# Altium project ElecStim.PrjPCB
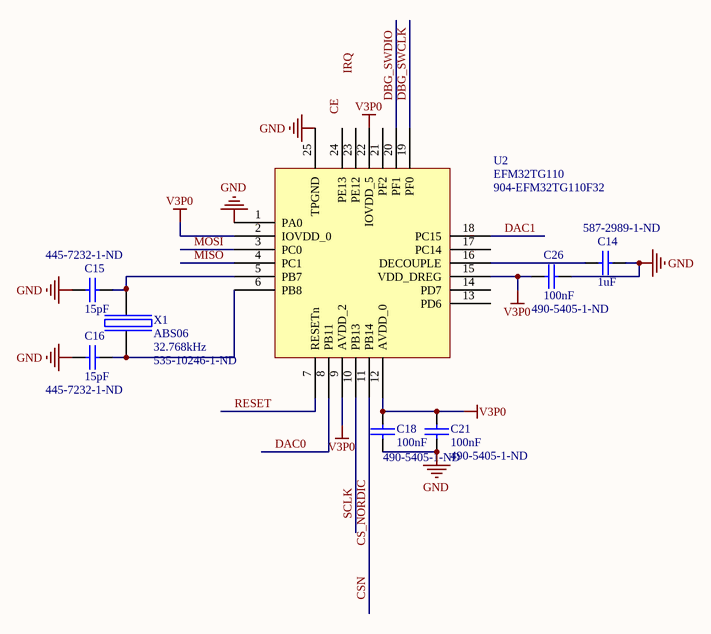
[diagram p0: MCU_EM.SchDoc]
4 sheets, 46 parts. Net scope: global (net labels, ports and power ports of the same name join across sheets).
Board file: PCB_Elec_stim.PcbDoc
Sheets:
  MCU_EM.SchDoc
  RF_Power_small_doubler.SchDoc
  Radio.SchDoc
  Bipolar_HCP.SchDoc

## Sheet MCU_EM.SchDoc
size A

### Parts
C14  value 1uF  Supplier Part Number 1: 587-2989-1-ND  [0402s]  (hidden comment: NP0 4V)
C15  value 15pF  Supplier Part Number 1: 445-7232-1-ND  [0201]  (hidden comment: NP0 50V)
C16  value 15pF  Supplier Part Number 1: 445-7232-1-ND  [0201]  (hidden comment: NP0 50V)
C18  value 100nF  Supplier Part Number 1: 490-5405-1-ND  [0201]  (hidden comment: NP0 10V)
C21  value 100nF  Supplier Part Number 1: 490-5405-1-ND  [0201]  (hidden comment: NP0 10V)
C26  value 100nF  Supplier Part Number 1: 490-5405-1-ND  [0402s]  (hidden comment: NP0 10V)
U2  EFM32TG110  Supplier Part Number 1: 904-EFM32TG110F32  [QFN24_EM]
X1  ABS06  Frequency: 32.768kHz  Supplier Part Number 1: 535-10246-1-ND  [ABS06]

### Nets
GND: C14.1 C15.1 C16.2 C18.2 C21.2 C26.2 U2.1(PA0) U2.25(TPGND)
V3P0: C18.1 C21.1 C26.1 U2.2(IOVDD_0) U2.9(AVDD_2) U2.12(AVDD_0) U2.15(VDD_DREG) U2.22(IOVDD_5)
CS_NORDIC: U2.11(PB14)  [also labelled CSN]
DAC0: U2.8(PB11)
DAC1: U2.18(PC15)
DBG_SWCLK: U2.19(PF0)
DBG_SWDIO: U2.20(PF1)
MISO: U2.4(PC1)
MOSI: U2.3(PC0)
RESET: U2.7(RESETn)
SCLK: U2.10(PB13)
NetC14_2: C14.2 U2.16(DECOUPLE)
NetC15_2: C15.2 U2.5(PB7) X1.1(inp)
NetC16_1: C16.1 U2.6(PB8) X1.2(out)

Not connected (* = marked no-connect by the designer): U2 13(PD6) 14(PD7) 17(PC14) 21(PF2) 23(PE12) 24(PE13)

### Notes on the sheet
- Labels drawn without touching a wire or pin: CE, IRQ

### Library data of the parts
C14 = Cap: Capacitor; Manufacturer: Taiyo Yuden; Manufacturer Part Number: AMK063ABJ105MP-F; Description: CAP CER 1UF 4V 20% X5R 0201; Capacitance: 1.0µF; Tolerance: ±20%; Temperature Coefficient: X5R; Supplier 1: Digi-Key; RoHS: RoHS Compliant; Category: Capacitors; Stock 1: 25231; Pricing 1: 1=0.56, 10=0.469, 50=0.336, 100=0.294, 250=0.231, 500=0.21, 1000=0.168, 5000=0.1295 (USD); Voltage - Rated: 4V; Mounting Type: Surface Mount, MLCC; Operating Temperature: -55°C ~ 85°C; Applications: General Purpose; Ratings: -; Package / Case: 0201 (0603 Metric); Size / Dimension: 0.024" L x 0.012" W (0.60mm x 0.30mm); Height - Seated (Max): -; Thickness (Max): 0.013" (0.33mm); Lead Spacing: -; Features: -; Packaging: Cut Tape (CT); Lead Style: -; ComponentLink1URL: http://www.yuden.co.jp/ut/product/pdf/mlcc01_e.pdf; ComponentLink1Description: http://www.yuden.co.jp/ut/product/pdf/mlcc01_e.pdf
C15 C16 = Cap: Capacitor; Part Field 1: 0402; Manufacturer: TDK Corporation; Manufacturer Part Number: C0603C0G1E150G; Description: CAP CER 15PF 25V 2% NP0 0201; Voltage - Rated: 25V; Tolerance: ±2%; Temperature Coefficient: C0G, NP0; Supplier 1: Digi-Key; RoHS: RoHS Compliant; Category: Capacitors; Stock 1: 29640; Pricing 1: 1=0.15, 10=0.093, 100=0.0333, 250=0.02404, 500=0.01776, 1000=0.01203 (USD); Capacitance: 15pF; Mounting Type: Surface Mount, MLCC; Operating Temperature: -55°C ~ 125°C; Applications: General Purpose; Ratings: -; Package / Case: 0201 (0603 Metric); Size / Dimension: 0.024" L x 0.012" W (0.60mm x 0.30mm); Height - Seated (Max): -; Thickness (Max): 0.013" (0.33mm); Lead Spacing: -; Features: -; Packaging: Cut Tape (CT); Lead Style: -; ComponentLink1URL: http://www.tdk.com/pdf/general_B11.pdf; ComponentLink1Description: http://www.tdk.com/pdf/general_B11.pdf
C18 C21 C26 = Cap: Capacitor; Part Field 1: 0402; Manufacturer: Murata Electronics North America; Manufacturer Part Number: GRM033R61A104ME15D; Description: CAP CER 0.1UF 10V 20% X5R 0201; Capacitance: 0.1µF; Tolerance: ±20%; Temperature Coefficient: X5R; Supplier 1: Digi-Key; RoHS: RoHS Compliant; Category: Capacitors; Stock 1: 1087710; Pricing 1: 10=0.05, 50=0.0396, 100=0.0297, 250=0.02144, 500=0.01584, 1000=0.01073, 5000=0.00825 (USD); Voltage - Rated: 10V; Mounting Type: Surface Mount, MLCC; Operating Temperature: -55°C ~ 85°C; Applications: General Purpose; Ratings: -; Package / Case: 0201 (0603 Metric); Size / Dimension: 0.024" L x 0.012" W (0.60mm x 0.30mm); Height - Seated (Max): -; Thickness (Max): 0.013" (0.33mm); Lead Spacing: -; Features: -; Packaging: Cut Tape (CT); Lead Style: -; ComponentLink1URL: http://www.murata.com/products/catalog/pdf/c02e.pdf; ComponentLink1Description: http://www.murata.com/products/catalog/pdf/c02e.pdf
U2 = EFM32TG110: EFM32TG110F32; Manufacturer: Energy Micro; Description: Microcontrollers (MCU) 32KB Flash 4KB RAM; Program Memory Type: Flash; Data RAM Size: 32 KB; Interface Type: UART, I2C, SPI; Core: ARM Cortex M3; Data Bus Width: 32 bit; Maximum Clock Frequency: 32 MHz; Number of Programmable I/Os: 17; Number of Timers: 1; Operating Supply Voltage: 1.8 V to 3.8 V; Processor Series: EFM32; Product Status: New Technology; Supplier 1: Mouser; Manufacturer Part Number: EFM32TG110F32; RoHS: RoHS Compliant; Category: Microcontrollers (MCU); Stock 1: 0; Pricing 1: 1=5.13, 10=4.66, 25=4.27, 100=3.87, 250=3.48, 500=3.20, 1000=2.61 (AUD); Package / Case: QFN-24; Mounting Style: SMD/SMT; Program Memory Size: 32 KB; Maximum Operating Temperature: + 85 C; RoHS - Mouser: Y; Minimum Order Quantity: 1; Reeling: False; ComponentLink1URL: http://cdn.energymicro.com/dl/devices/pdf/d0013_efm32tg110_datasheet.pdf; ComponentLink1Description: http://cdn.energymicro.com/dl/devices/pdf/d0013_efm32tg110_datasheet.pdf
X1 = ABS06: Manufacturer: Abracon Corporation; Manufacturer Part Number: ABS06-32.768KHZ-9-T; Description: CRYSTAL 32.768 KHZ 9.0 PF SMD; Frequency Tolerance: ±20ppm; Load Capacitance: 9pF; Operating Mode: Fundamental; Supplier 1: Digi-Key; RoHS: RoHS Compliant; Category: Crystals and Oscillators; Stock 1: 7776; Pricing 1: 1=2.55, 10=2.21, 50=1.938, 100=1.53, 500=1.292 (USD); Type: kHz Crystal (Tuning Fork); Frequency Stability: -; Operating Temperature: -40°C ~ 85°C; Mounting Type: Surface Mount; Package / Case: 2-SMD; Size / Dimension: 0.079" L x 0.047" W (2.00mm x 1.20mm); Height: 0.024" (0.60mm); Packaging: Cut Tape (CT); ComponentLink1URL: http://www.abracon.com/Resonators/ABS06.pdf; ComponentLink1Description: http://www.abracon.com/Resonators/ABS06.pdf

## Sheet RF_Power_small_doubler.SchDoc
size A
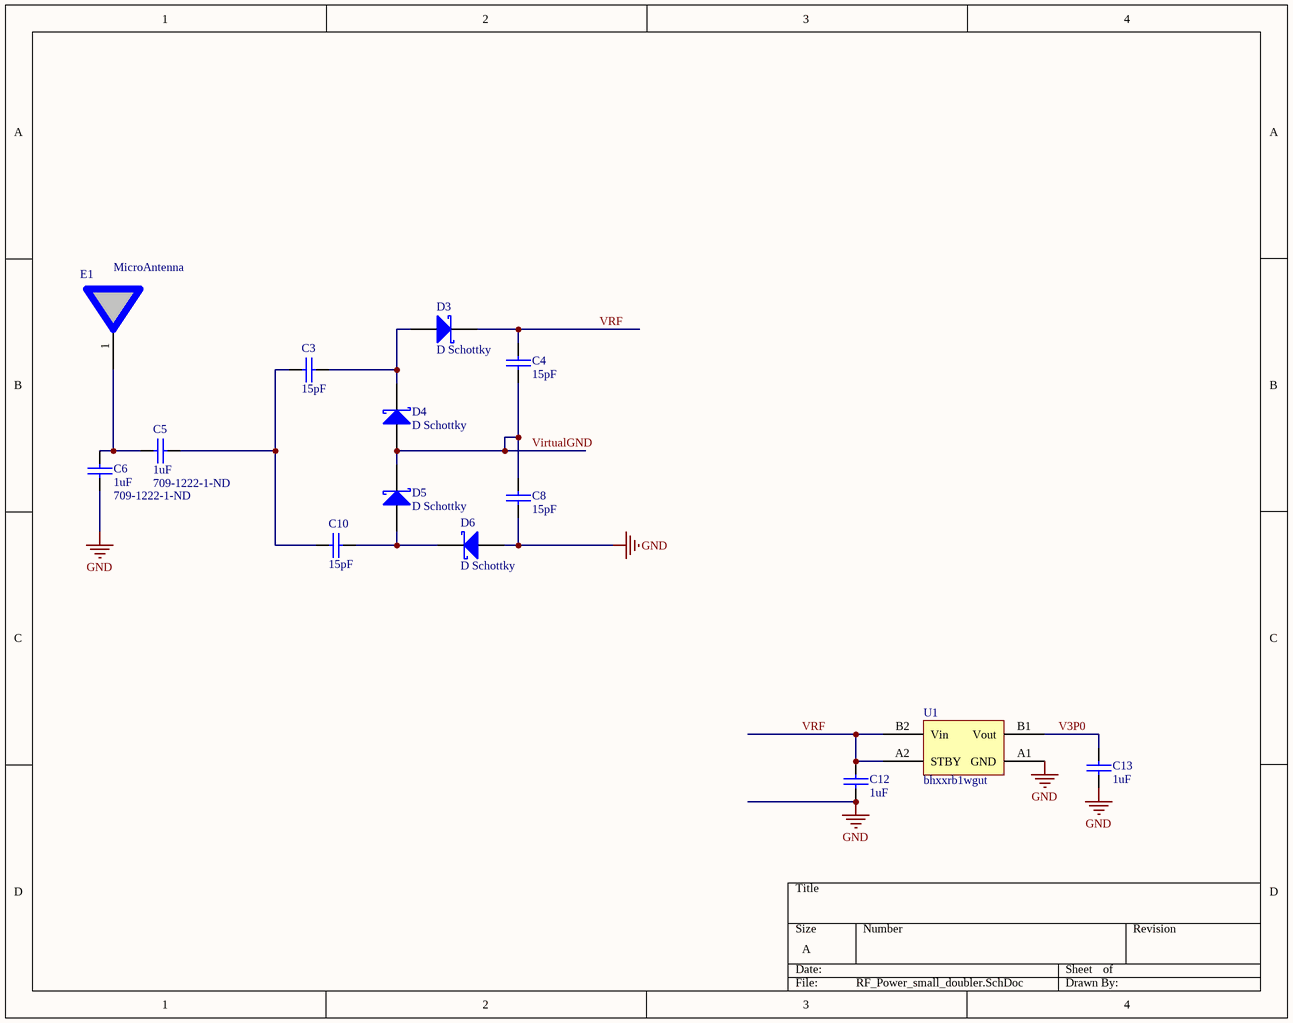
[diagram p1: RF_Power_small_doubler.SchDoc]

### Parts
C3  value 15pF  [0201]  (hidden comment: NP0 50V)
C4  value 15pF  [0201]  (hidden comment: NP0 50V)
C5  value 1uF  Supplier Part Number 1: 709-1222-1-ND  [0402]  (hidden comment: NP0 50V)
C6  value 1uF  Supplier Part Number 1: 709-1222-1-ND  [0402]  (hidden comment: NP0 50V)
C8  value 15pF  [0201]  (hidden comment: NP0 50V)
C10  value 15pF  [0201]  (hidden comment: NP0 50V)
C12  value 1uF  [CAPC1005L]  (hidden comment: NP0 50V)
C13  value 1uF  [CAPC1005L]  (hidden comment: NP0 50V)
D3  D Schottky  [Diode0201]
D4  D Schottky  [Diode0201]
D5  D Schottky  [Diode0201]
D6  D Schottky  [Diode0201]
E1  MicroAntenna  [2450AT18B100]
U1  bhxxrb1wgut  [BGA2x2_p5]

### Nets
GND: C6.2 C8.2 C12.2 C13.1 D6.1(A) U1.A1(GND)
V3P0: C13.2 U1.B1(Vout)
VirtualGND: C4.2 C8.1 D4.1(A) D5.2(K)
VRF: C4.1 C12.1 D3.2(K) U1.A2(STBY) U1.B2(Vin)
NetC3_1: C3.1 D3.1(A) D4.2(K)
NetC3_2: C3.2 C5.1 C10.2
NetC5_2: C5.2 C6.1 E1.1
NetC10_1: C10.1 D5.1(A) D6.2(K)

Not connected (* = marked no-connect by the designer): E1 2

### Library data of the parts
C3 C4 C8 C10 = Cap: Capacitor; Part Field 1: 0201
C5 C6 = Cap: Capacitor; Manufacturer: Johanson Dielectrics Inc; Manufacturer Part Number: 100R07X105KV4T; Description: CAP CER 1UF 10V X5R 0402; Capacitance: 1.0µF; Voltage - Rated: 10V; Tolerance: ±10%; Temperature Coefficient: X5R; Part Field 1: 0402; Supplier 1: Digi-Key; RoHS: RoHS Compliant; Category: Capacitors; Stock 1: 22620; Pricing 1: 10=0.146, 100=0.0861, 500=0.04968, 1000=0.03445 (USD); Mounting Type: Surface Mount, MLCC; Operating Temperature: -55°C ~ 85°C; Applications: SMPS Filtering; Ratings: -; Package / Case: 0402 (1005 Metric); Size / Dimension: 0.040" L x 0.020" W (1.02mm x 0.51mm); Height: -; Thickness: 0.025" (0.64mm); Lead Spacing: -; Features: -; Packaging: Cut Tape (CT); Lead Style: -; ComponentLink1URL: http://www.johansondielectrics.com/images/stories/surface-mount/tanceram/JDI_Tanceram_2010-03.pdf; ComponentLink1Description: http://www.johansondielectrics.com/images/stories/surface-mount/tanceram/JDI_Tanceram_2010-03.pdf
C12 C13 = Cap: Capacitor; Part Field 1: 0201
D3-D6 = D Schottky: Schottky Diode; Published: 8-Jun-2000; LatestRevisionDate: 17-Jul-2002; LatestRevisionNote: Re-released for DXP Platform.; PackageReference: SMB; Publisher: Altium Limited; PackageDescription: DO-214-AA/SMB; 2 C-Bend Leads; Body 5.3 x 3.6 mm, inc. leads (LxW); Code_JEDEC: DO-214-AA

## Sheet Radio.SchDoc
size A
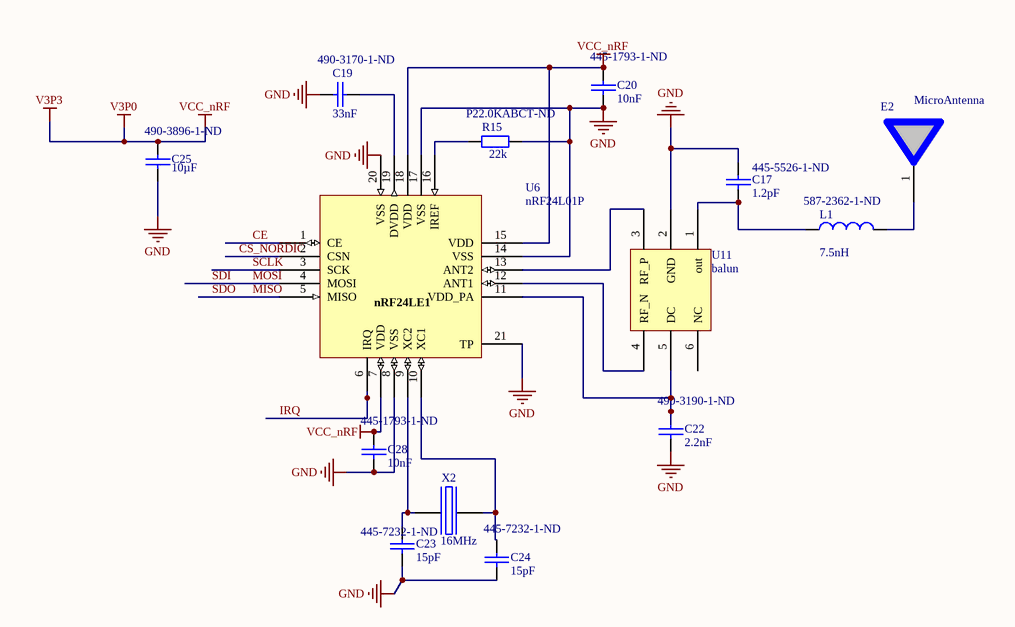
[diagram p2: Radio.SchDoc]

### Parts
C17  value 1.2pF  Supplier Part Number 1: 445-5526-1-ND  [0201]  (hidden comment: NP0 50V)
C19  value 33nF  Supplier Part Number 1: 490-3170-1-ND  [0201]  (hidden comment: NP0 50V)
C20  value 10nF  Supplier Part Number 1: 445-1793-1-ND  [0201]  (hidden comment: NP0 50V)
C22  value 2.2nF  Supplier Part Number 1: 490-3190-1-ND  [0201]  (hidden comment: NP0 50V)
C23  value 15pF  Supplier Part Number 1: 445-7232-1-ND  [0603]  (hidden comment: NP0 50V)
C24  value 15pF  Supplier Part Number 1: 445-7232-1-ND  [0603]  (hidden comment: NP0 50V)
C25  Supplier Part Number 1: 490-3896-1-ND  Capacitance: 10µF  [1608[0603]]  (hidden comment: NP0 50V)
C28  value 10nF  Supplier Part Number 1: 445-1793-1-ND  [0201]  (hidden comment: NP0 50V)
E2  MicroAntenna  [microantenna]
L1  value 7.5nH  Supplier Part Number 1: 587-2362-1-ND  [0201]  (hidden comment: Inductor)
R15  value 22k  Supplier Part Number 1: P22.0KABCT-ND  [0201]  (hidden comment: Res2)
U6  value nRF24L01P  [NORDIC_QFN20P400X400X90-25N]  (hidden comment: QFN24 4x4 package)
U11  balun  [balun]
X2  value 16MHz  [bt-xtal 2.5 x 2 mm]  (hidden comment: TSX-3225, 16MHz, Cl=9pF, +/-10ppm)

### Nets
GND: C17.1 C19.1 C20.2 C22.2 C23.2 C24.1 C25.2 C28.2 R15.2 U6.8(VSS) U6.14(VSS) U6.17(VSS) U6.20(VSS) U6.21(TP) U11.2(GND) X2.2(GND) X2.4(GND)
V3P0: C20.1 C25.1 C28.1 U6.7(VDD) U6.15(VDD) U6.18(VDD)  [also labelled V3P3, VCC_nRF]
CE: U6.1(CE)
CS_NORDIC: U6.2(CSN)
IRQ: U6.6(IRQ)
MISO: U6.5(MISO)  [also labelled SDO]
MOSI: U6.4(MOSI)  [also labelled SDI]
SCLK: U6.3(SCK)
NetC17_2: C17.2 L1.1 U11.1(out)
NetC19_2: C19.2 U6.19(DVDD)
NetC22_1: C22.1 U6.11(VDD_PA) U11.5(DC)
NetC23_1: C23.1 U6.9(XC2) X2.1(inp)
NetC24_2: C24.2 U6.10(XC1) X2.3(out)
NetE2_1: E2.1 L1.2
NetR15_1: R15.1 U6.16(IREF)
NetU6_12: U6.12(ANT1) U11.4(RF_N)
NetU6_13: U6.13(ANT2) U11.3(RF_P)

Not connected (* = marked no-connect by the designer): E2 2; U11 6(NC)

### Notes on the sheet
- (in symbol nRF24L01P - 4x4) nRF24LE1

### Library data of the parts
C17 = Cap: Capacitor; Part Field 1: 0402; Manufacturer: TDK Corporation; Manufacturer Part Number: C0603C0G1E1R2BTQ; Description: CAP CER 1.2PF 25V NP0 0201; Voltage - Rated: 25V; Tolerance: ±0.1pF; Temperature Coefficient: C0G, NP0; Supplier 1: Digi-Key; RoHS: RoHS Compliant; Category: Capacitors; Stock 1: 22019; Pricing 1: 1=0.33, 10=0.22, 100=0.088, 250=0.06324, 500=0.0451, 1000=0.033 (USD); Capacitance: 1.2pF; Mounting Type: Surface Mount, MLCC; Operating Temperature: -55°C ~ 125°C; Applications: RF, Microwave, High Frequency; Ratings: -; Package / Case: 0201 (0603 Metric); Size / Dimension: 0.024" L x 0.012" W (0.60mm x 0.30mm); Height - Seated (Max): -; Thickness (Max): 0.013" (0.33mm); Lead Spacing: -; Features: High Q, Low Loss; Packaging: Cut Tape (CT); Lead Style: -; ComponentLink1URL: http://www.tdk.com/pdf/high_q_B11.pdf; ComponentLink1Description: http://www.tdk.com/pdf/high_q_B11.pdf
C19 = Cap: Capacitor; Part Field 1: 0402; Manufacturer: Murata Electronics North America; Manufacturer Part Number: GRM033R60J333KE01D; Description: CAP CER 0.033UF 6.3V X5R 0201; Capacitance: 0.033µF; Voltage - Rated: 6.3V; Tolerance: ±10%; Temperature Coefficient: X5R; Supplier 1: Digi-Key; RoHS: RoHS Compliant; Category: Capacitors; Stock 1: 79017; Pricing 1: 10=0.05, 50=0.0396, 100=0.0297, 250=0.02144, 500=0.01584, 1000=0.01073 (USD); Mounting Type: Surface Mount, MLCC; Operating Temperature: -55°C ~ 85°C; Applications: General Purpose; Ratings: -; Package / Case: 0201 (0603 Metric); Size / Dimension: 0.024" L x 0.012" W (0.60mm x 0.30mm); Height - Seated (Max): -; Thickness (Max): 0.013" (0.33mm); Lead Spacing: -; Features: -; Packaging: Cut Tape (CT); Lead Style: -; ComponentLink1URL: http://search.murata.co.jp/Ceramy/image/img/PDF/ENG/GRM033R60J333KE01.pdf; ComponentLink1Description: http://search.murata.co.jp/Ceramy/image/img/PDF/ENG/GRM033R60J333KE01.pdf
C20 C28 = Cap: Capacitor; Part Field 1: 0402; Manufacturer: TDK Corporation; Manufacturer Part Number: C0603X5R1A103K; Description: CAP CER 10000PF 10V 10% X5R 0201; Capacitance: 10000pF; Voltage - Rated: 10V; Tolerance: ±10%; Temperature Coefficient: X5R; Supplier 1: Digi-Key; RoHS: RoHS Compliant; Category: Capacitors; Stock 1: 651645; Pricing 1: 1=0.08, 10=0.05, 100=0.018, 250=0.013, 500=0.0096, 1000=0.0065 (USD); Mounting Type: Surface Mount, MLCC; Operating Temperature: -55°C ~ 85°C; Applications: General Purpose; Ratings: -; Package / Case: 0201 (0603 Metric); Size / Dimension: 0.024" L x 0.012" W (0.60mm x 0.30mm); Height - Seated (Max): -; Thickness (Max): 0.013" (0.33mm); Lead Spacing: -; Features: -; Packaging: Cut Tape (CT); Lead Style: -; ComponentLink1URL: http://www.tdk.com/pdf/general_B11.pdf; ComponentLink1Description: http://www.tdk.com/pdf/general_B11.pdf
C22 = Cap: Capacitor; Manufacturer: Murata Electronics North America; Manufacturer Part Number: GRM033R71C222KA88D; Description: CAP CER 2200PF 16V 10% X7R 0201; Capacitance: 2200pF; Voltage - Rated: 16V; Tolerance: ±10%; Temperature Coefficient: X7R; Supplier 1: Digi-Key; RoHS: RoHS Compliant; Category: Capacitors; Stock 1: 60723; Pricing 1: 10=0.032, 50=0.0252, 100=0.0189, 250=0.01364, 500=0.01008, 1000=0.00683, 5000=0.00525 (USD); Mounting Type: Surface Mount, MLCC; Operating Temperature: -55°C ~ 125°C; Applications: General Purpose; Ratings: -; Package / Case: 0201 (0603 Metric); Size / Dimension: 0.024" L x 0.012" W (0.60mm x 0.30mm); Height - Seated (Max): -; Thickness (Max): 0.013" (0.33mm); Lead Spacing: -; Features: -; Packaging: Cut Tape (CT); Lead Style: -; ComponentLink1URL: http://search.murata.co.jp/Ceramy/image/img/PDF/ENG/GRM033R71C222KA88.pdf; ComponentLink1Description: http://search.murata.co.jp/Ceramy/image/img/PDF/ENG/GRM033R71C222KA88.pdf
C23 C24 = Cap: as C15 on sheet MCU_EM; Supplier 1: Digi-Key; RoHS: RoHS Compliant; Category: Capacitors; Stock 1: 29640; Pricing 1: 1=0.15, 10=0.093, 100=0.0333, 250=0.02404, 500=0.01776, 1000=0.01203 (USD); Capacitance: 15pF; Mounting Type: Surface Mount, MLCC; Operating Temperature: -55°C ~ 125°C; Applications: General Purpose; Ratings: -; Package / Case: 0201 (0603 Metric); Size / Dimension: 0.024" L x 0.012" W (0.60mm x 0.30mm); Height - Seated (Max): -; Thickness (Max): 0.013" (0.33mm); Lead Spacing: -; Features: -; Packaging: Cut Tape (CT); Lead Style: -; ComponentLink1URL: http://www.tdk.com/pdf/general_B11.pdf; ComponentLink1Description: http://www.tdk.com/pdf/general_B11.pdf
C25 = Cap: Capacitor; Part Field 1: 0402; Manufacturer: Murata Electronics North America; Manufacturer Part Number: GRM188R60J106ME47D; Value: 10uF; Description: CAP CER 10UF 6.3V X5R 0603; Voltage - Rated: 6.3V; Tolerance: ±20%; Temperature Coefficient: X5R; Supplier 1: Digi-Key; RoHS: RoHS Compliant; Category: Capacitors; Stock 1: 1364710; Pricing 1: 1=0.51, 10=0.398, 50=0.2624, 100=0.208, 250=0.15376, 500=0.1194, 1000=0.09407 (USD); Mounting Type: Surface Mount, MLCC; Operating Temperature: -55°C ~ 85°C; Applications: General Purpose; Ratings: -; Package / Case: 0603 (1608 Metric); Size / Dimension: 0.063" L x 0.031" W (1.60mm x 0.80mm); Height: -; Thickness: 0.035" (0.90mm); Lead Spacing: -; Features: -; Packaging: Cut Tape (CT); Lead Style: -; ComponentLink1URL: http://search.murata.co.jp/Ceramy/image/img/PDF/ENG/GRM188R60J106ME47.pdf; ComponentLink1Description: http://search.murata.co.jp/Ceramy/image/img/PDF/ENG/GRM188R60J106ME47.pdf
L1 = Inductor: Manufacturer: Taiyo Yuden; Manufacturer Part Number: HKQ0603S7N5H-T; Code_IEC: 1005; Description: INDUCTOR HI FREQ 7.5NH 0201; Current: 200mA; Tolerance: ±3%; DC Resistance (DCR): 510 mOhm Max; Q @ Freq: 13 @ 500MHz; Frequency - Self Resonant: 4.6GHz; Frequency - Test: 500MHz; Published: 8-Jun-2000; LatestRevisionDate: 29-May-2009; LatestRevisionNote: IPC-7351 Footprint Added.; PackageReference: 0402-A; Publisher: Altium Limited; PackageDescription: Chip Inductor; Code_JEITA: 0402; Supplier 1: Digi-Key; RoHS: RoHS Compliant; Category: Inductors, Coils, Chokes; Stock 1: 99075; Pricing 1: 1=0.06, 10=0.052, 50=0.0488, 100=0.0455, 500=0.03576, 1000=0.02925, 5000=0.0234 (USD); Inductance: 7.5nH; Current - Saturation: -; Current - Temperature Rise: -; Type: -; Shielding: -; Package / Case: 0201 (0603 Metric); Mounting Type: Surface Mount; Packaging: Cut Tape (CT); Operating Temperature: -55°C ~ 125°C; Material - Core: -; Applications: High Frequency; ComponentLink1URL: http://www.yuden.co.jp/productdata/catalog/en/mlci05_e.pdf; ComponentLink1Description: http://www.yuden.co.jp/productdata/catalog/en/mlci05_e.pdf
R15 = Res2: Resistor; Manufacturer: Panasonic - ECG; Manufacturer Part Number: ERJ-1GEF2202C; Description: RES 22.0K OHM 1/20W 1% 0201 SMD; Power (Watts): 0.05W, 1/20W; Temperature Coefficient: ±200ppm/°C; Tolerance: ±1%; Category: Resistors; Supplier 1: Digi-Key; RoHS: RoHS Compliant; Stock 1: 526882; Pricing 1: 1=0.11, 50=0.0414, 100=0.0315, 250=0.0234, 500=0.01728, 1000=0.01152, 5000=0.0081 (USD); Resistance (Ohms): 22K; Composition: Thick Film; Features: -; Size / Dimension: 0.024" L x 0.012" W (0.60mm x 0.30mm); Height: 0.010" (0.26mm); Number of Terminations: 2; Packaging: Cut Tape (CT); Package / Case: 0201 (0603 Metric); ComponentLink1URL: http://industrial.panasonic.com/www-data/pdf/AOA0000/AOA0000CE2.pdf; ComponentLink1Description: http://industrial.panasonic.com/www-data/pdf/AOA0000/AOA0000CE2.pdf
U6 = nRF24L01P - 4x4: 2.4GHz Tranceiver with embedded MCU and 10 bit ADC
X2 = BT-XTAL: Crystal; Manufacturer: NDK; Manufacturer Part Number: NX2520SA-16.000000MHZ; Description: CRYSTAL 16.000000 MHZ 10PF SMD; Frequency Stability: ±10ppm; Load Capacitance: 10pF; Operating Mode: Fundamental; Supplier 1: Digi-Key; Supplier Part Number 1: 644-1059-1-ND; RoHS: RoHS Compliant; Category: Crystals and Oscillators; Stock 1: 12667; Pricing 1: 1=2.12, 10=1.839, 50=1.6128, 100=1.2733, 500=1.07524, 750=0.93943, 1000=0.84888 (USD); Type: MHz Crystal; Frequency: 16MHz; Frequency Tolerance: ±10ppm; Operating Temperature: -10°C ~ 60°C; Mounting Type: Surface Mount; Package / Case: 4-SMD, No Lead (DFN, LCC); Size / Dimension: 0.098" L x 0.079" W (2.50mm x 2.00mm); Height: 0.026" (0.65mm); Packaging: Cut Tape (CT); ComponentLink1URL: http://media.digikey.com/pdf/Data%20Sheets/NDK%20PDFs/NX2520SA.pdf; ComponentLink1Description: http://media.digikey.com/pdf/Data%20Sheets/NDK%20PDFs/NX2520SA.pdf

## Sheet Bipolar_HCP.SchDoc
size A
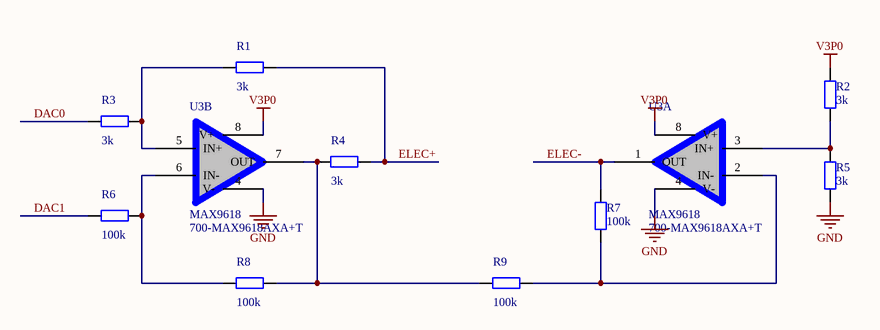
[diagram p3: Bipolar_HCP.SchDoc]

### Parts
R1  value 3k  [0402]  (hidden comment: Res2)
R2  value 3k  [0201]  (hidden comment: Res2)
R3  value 3k  [0402]  (hidden comment: Res2)
R4  value 3k  [0201]  (hidden comment: Res2)
R5  value 3k  [0201]  (hidden comment: Res2)
R6  value 100k  [0201]  (hidden comment: Res2)
R7  value 100k  [0201]  (hidden comment: Res2)
R8  value 100k  [0201]  (hidden comment: Res2)
R9  value 100k  [0201]  (hidden comment: Res2)
U3  MAX9618  Supplier Part Number 1: 700-MAX9618AXA+T  [MAX_X8CN_SC70_8]  (parts A,B of 2)

### Nets
GND: R5.2 U3.4(V-)
V3P0: R2.1 U3.8(V+)
DAC0: R3.2
DAC1: R6.2
ELEC+: R1.1 R4.1
ELEC-: R7.1 U3.1(OUT)
NetR1_2: R1.2 R3.1 U3.5(IN+)
NetR2_2: R2.2 R5.1 U3.3(IN+)
NetR4_2: R4.2 R8.1 R9.2 U3.7(OUT)
NetR6_1: R6.1 R8.2 U3.6(IN-)
NetR7_2: R7.2 R9.1 U3.2(IN-)

### Library data of the parts
R1-R9 = Res2: Resistor; Category: Resistors
U3 = MAX9618: Manufacturer: Maxim Integrated Products; Manufacturer Part Number: MAX9618AXA+T; Description: Op Amps Dual Auto-Zero Op Amp; Input Bias Current (Max): 3.5 nA; Supply Current: 59 uA; Common Mode Rejection Ratio (Min): 116 dB; Slew Rate: 0.7 V/us; Input Offset Voltage: 0.8 uV; Product Status: New at Mouser; Supplier 1: Mouser; RoHS: RoHS Compliant; Category: Op Amps; Stock 1: 1997; Pricing 1: 1=3.95, 25=2.92, 100=2.12, 500=1.84 (USD); Package / Case: SC70-8; Packaging: Reel; Mounting Style: SMD/SMT; Maximum Operating Temperature: + 125 C; Minimum Operating Temperature: - 40 C; Standard Pack Qty: 2500; RoHS - Mouser: Y; Minimum Order Quantity: 1; Reeling: True; ComponentLink1URL: http://datasheets.maxim-ic.com/en/ds/MAX9617-MAX9620.pdf; ComponentLink1Description: http://datasheets.maxim-ic.com/en/ds/MAX9617-MAX9620.pdf

## Nets that join several sheets
GND: MCU_EM (8 pins), RF_Power_small_doubler (6 pins), Radio (17 pins), Bipolar_HCP (R5.2 U3.4)
V3P0: MCU_EM (8 pins), RF_Power_small_doubler (C13.2 U1.B1), Radio (6 pins), Bipolar_HCP (R2.1 U3.8)
CS_NORDIC: MCU_EM (U2.11), Radio (U6.2)
DAC0: MCU_EM (U2.8), Bipolar_HCP (R3.2)
DAC1: MCU_EM (U2.18), Bipolar_HCP (R6.2)
MISO: MCU_EM (U2.4), Radio (U6.5)
MOSI: MCU_EM (U2.3), Radio (U6.4)
SCLK: MCU_EM (U2.10), Radio (U6.3)